# EAGLE design MegaU4Dev (EAGLE 5.11)
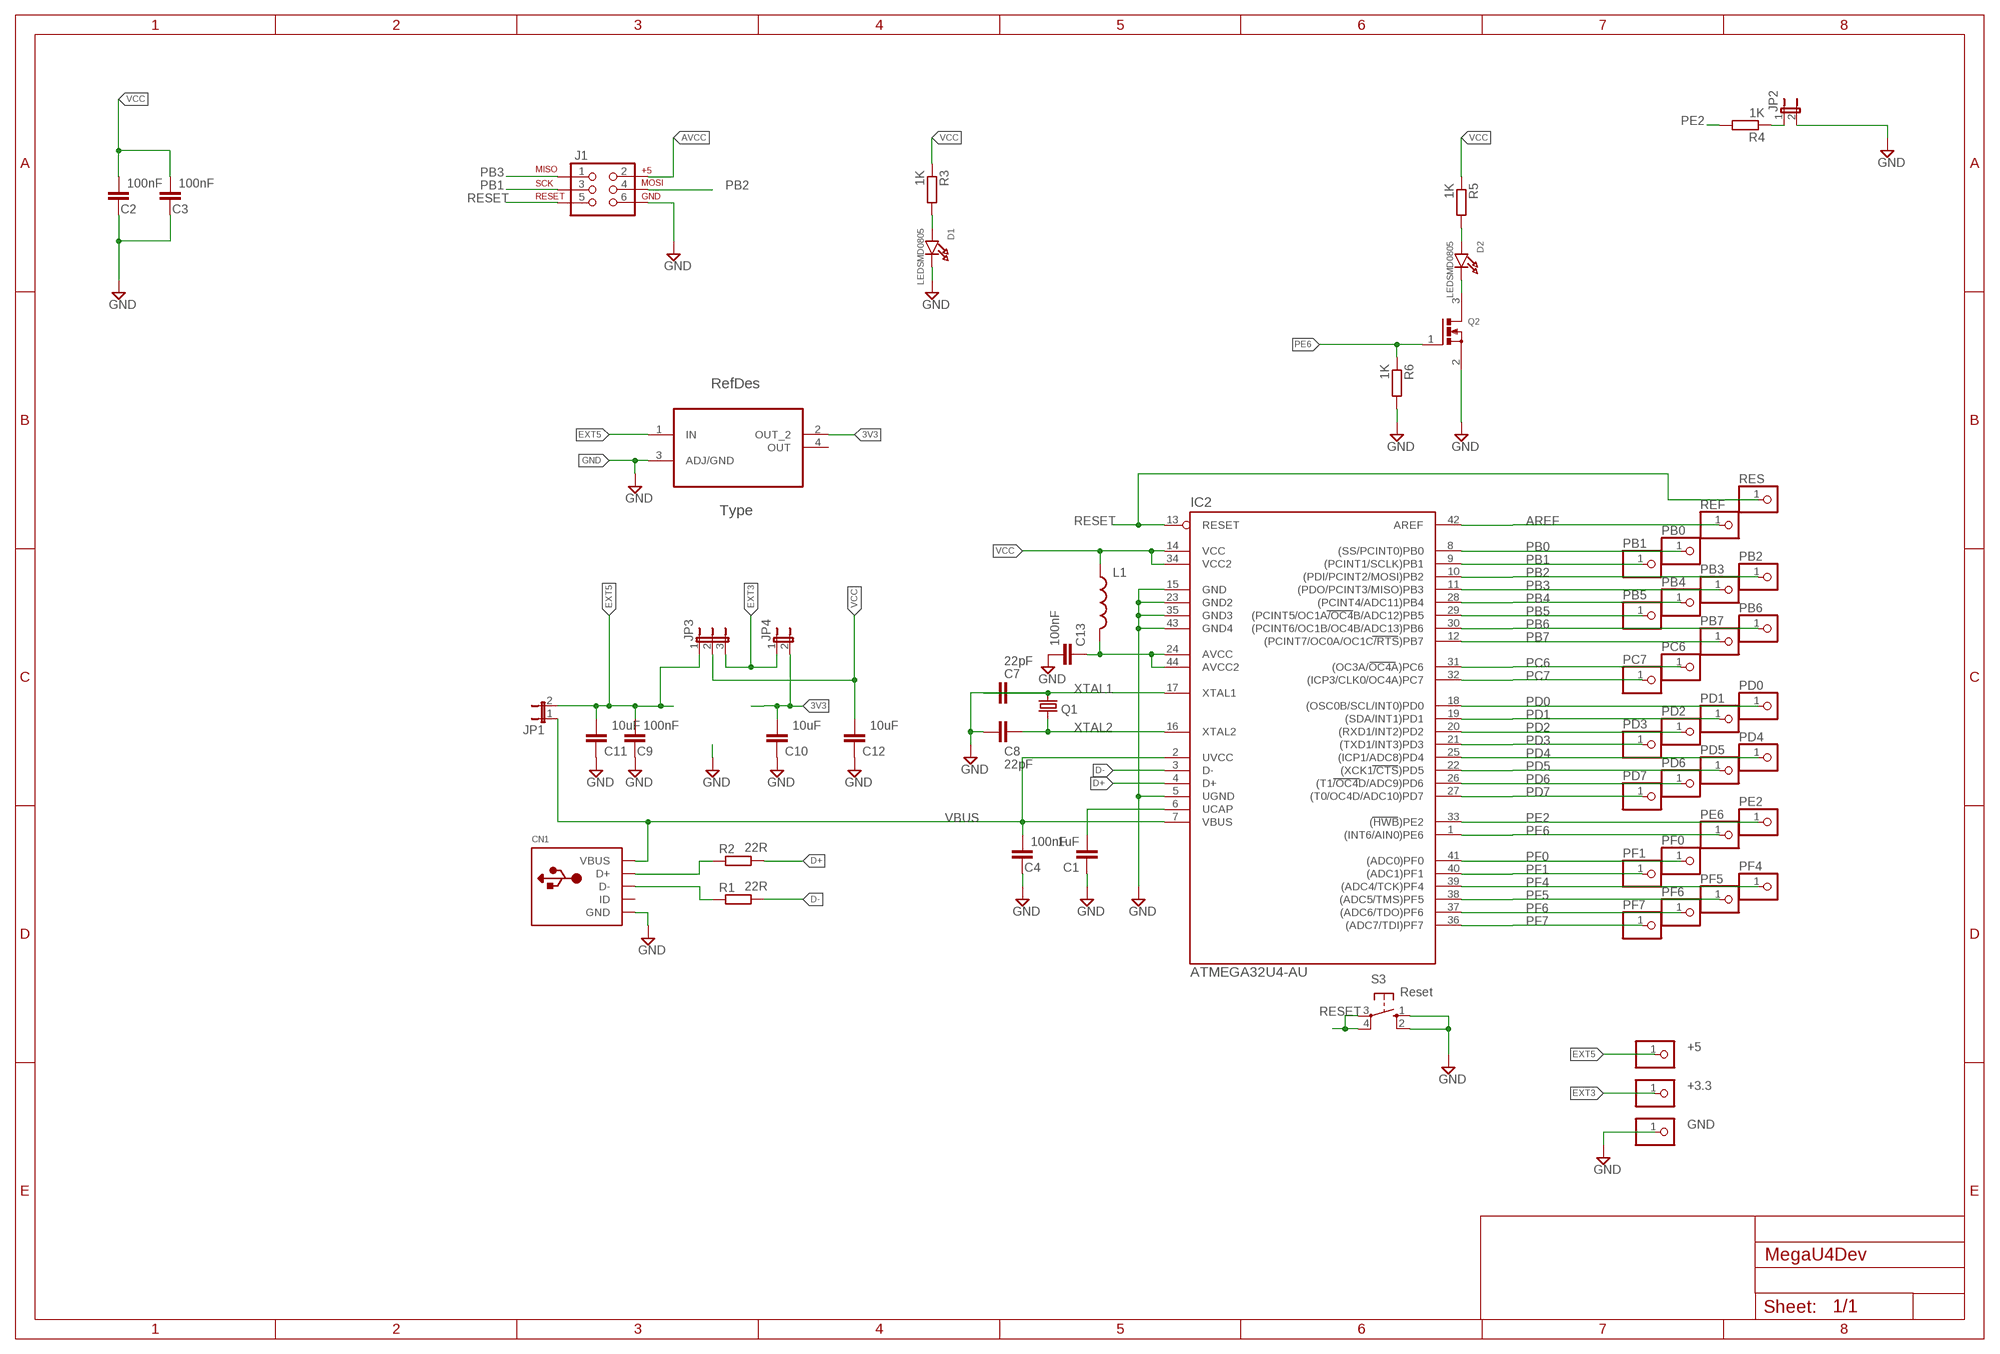
[diagram p0: schematic, sheet 1]

## Parts
+3.3  PINHD-1X1  [1X01]
+5  PINHD-1X1  [1X01]
C1  1uF  C-EUC0805  [C0805]
C2  100nF  C-EUC0805  [C0805]
C3  100nF  C-EUC0805  [C0805]
C4  100nF  C-EUC0805  [C0805]
C7  22pF  C-EUC0805  [C0805]
C8  22pF  C-EUC0805  [C0805]
C9  100nF  C-EUC0805  [C0805]
C10  10uF  C-EUC0805  [C0805]
C11  10uF  C-EUC0805  [C0805]
C12  10uF  C-EUC0805  [C0805]
C13  100nF  C-EUC0805  [C0805]
CN1  USBMINIB  [USB-MINIB]
D1  LEDSMD0805  [CHIPLED_0805]
D2  LEDSMD0805  [CHIPLED_0805]
GND  PINHD-1X1  [1X01]
IC2  ATMEGA32U4-AU  [TQFP44]
J1  AVR_SPI_PRG_6NS  [2X3-NS]
JP1  JP1E  [JP1]
JP2  JUMPER-2PTH  [1X02]
JP3  JP2E  [JP2]
JP4  JP1E  [JP1]
L1  INDUCTOR0805  [0805]
PB0  PINHD-1X1  [1X01]
PB1  PINHD-1X1  [1X01]
PB2  PINHD-1X1  [1X01]
PB3  PINHD-1X1  [1X01]
PB4  PINHD-1X1  [1X01]
PB5  PINHD-1X1  [1X01]
PB6  PINHD-1X1  [1X01]
PB7  PINHD-1X1  [1X01]
PC6  PINHD-1X1  [1X01]
PC7  PINHD-1X1  [1X01]
PD0  PINHD-1X1  [1X01]
PD1  PINHD-1X1  [1X01]
PD2  PINHD-1X1  [1X01]
PD3  PINHD-1X1  [1X01]
PD4  PINHD-1X1  [1X01]
PD5  PINHD-1X1  [1X01]
PD6  PINHD-1X1  [1X01]
PD7  PINHD-1X1  [1X01]
PE2  PINHD-1X1  [1X01]
PE6  PINHD-1X1  [1X01]
PF0  PINHD-1X1  [1X01]
PF1  PINHD-1X1  [1X01]
PF4  PINHD-1X1  [1X01]
PF5  PINHD-1X1  [1X01]
PF6  PINHD-1X1  [1X01]
PF7  PINHD-1X1  [1X01]
Q1  CRYSTALSM49  [SM49]
Q2  MOSFET-NWAVE  [SOT23-W]
R1  22R  R-EU_M0805  [M0805]
R2  22R  R-EU_M0805  [M0805]
R3  1K  R-EU_M0805  [M0805]
R4  1K  R-EU_M0805  [M0805]
R5  1K  R-EU_M0805  [M0805]
R6  1K  R-EU_M0805  [M0805]
REF  PINHD-1X1  [1X01]
RES  PINHD-1X1  [1X01]
S3  Reset  10-XX  [B3F-10XX]
U1  TLV1117-33CDCYW  [SOT223]

## Nets
3V3: C10.2 JP4.2 U1.2(OUT_2)
AREF: IC2.42(AREF) REF.1
AVCC: C13.1 IC2.24(AVCC) IC2.44(AVCC2) J1.2 L1.2
D+: IC2.4(D+) R2.2
D-: IC2.3(D-) R1.2
EXT3: +3.3.1 JP3.3 JP4.1
EXT5: +5.1 C9.2 C11.2 JP1.2 JP3.1 U1.1(IN)
GND: C1.1 C2.1 C3.1 C4.1 C7.2 C8.2 C9.1 C10.1 C11.1 C12.1 C13.2 CN1.GND D1.C GND.1 IC2.5(UGND) IC2.15(GND) IC2.23(GND2) IC2.35(GND3) IC2.43(GND4) J1.6 JP2.2 Q2.2(S) R6.2 S3.1(S) S3.2(S1) U1.3(ADJ/GND)
N$1: JP2.1 R4.1
N$2: CN1.D- R1.1
N$3: CN1.D+ R2.1
N$5: D2.A R5.2
N$6: D1.A R3.2
N$7: D2.C Q2.3(D)
PB0: IC2.8((SS/PCINT0)PB0) PB0.1
PB1: IC2.9((PCINT1/SCLK)PB1) J1.3 PB1.1
PB2: IC2.10((PDI/PCINT2/MOSI)PB2) J1.4 PB2.1
PB3: IC2.11((PDO/PCINT3/MISO)PB3) J1.1 PB3.1
PB4: IC2.28((PCINT4/ADC11)PB4) PB4.1
PB5: IC2.29((PCINT5/OC1A/OC4B/ADC12)PB5) PB5.1
PB6: IC2.30((PCINT6/OC1B/OC4B/ADC13)PB6) PB6.1
PB7: IC2.12((PCINT7/OC0A/OC1C/RTS)PB7) PB7.1
PC6: IC2.31((OC3A/OC4A)PC6) PC6.1
PC7: IC2.32((ICP3/CLK0/OC4A)PC7) PC7.1
PD0: IC2.18((OSC0B/SCL/INT0)PD0) PD0.1
PD1: IC2.19((SDA/INT1)PD1) PD1.1
PD2: IC2.20((RXD1/INT2)PD2) PD2.1
PD3: IC2.21((TXD1/INT3)PD3) PD3.1
PD4: IC2.25((ICP1/ADC8)PD4) PD4.1
PD5: IC2.22((XCK1/CTS)PD5) PD5.1
PD6: IC2.26((T1/OC4D/ADC9)PD6) PD6.1
PD7: IC2.27((T0/OC4D/ADC10)PD7) PD7.1
PE2: IC2.33((HWB)PE2) PE2.1 R4.2
PE6: IC2.1((INT6/AIN0)PE6) PE6.1 Q2.1(G) R6.1
PF0: IC2.41((ADC0)PF0) PF0.1
PF1: IC2.40((ADC1)PF1) PF1.1
PF4: IC2.39((ADC4/TCK)PF4) PF4.1
PF5: IC2.38((ADC5/TMS)PF5) PF5.1
PF6: IC2.37((ADC6/TDO)PF6) PF6.1
PF7: IC2.36((ADC7/TDI)PF7) PF7.1
RESET: IC2.13(RESET) J1.5 RES.1 S3.3(P) S3.4(P1)
UCAP: C1.2 IC2.6(UCAP)
VBUS: C4.2 CN1.VBUS IC2.2(UVCC) IC2.7(VBUS) JP1.1
VCC: C2.2 C3.2 C12.2 IC2.14(VCC) IC2.34(VCC2) JP3.2 L1.1 R3.1 R5.1
XTAL1: C7.1 IC2.17(XTAL1) Q1.2
XTAL2: C8.1 IC2.16(XTAL2) Q1.1
Unconnected: CN1.ID U1.4(OUT)

## Library data of the parts
+3.3 +5 GND PB0 PB1-PB7 PC6 PC7 PD0 PD1-PD7 PE2 PE6 PF0 PF1 PF4-PF7 REF RES = adafruit:PINHD-1X1: Pin header 1x1 for 0.1" spacing With round pins
C1-C4 C7-C13 = rcl:C-EU: CAPACITOR, European symbol
CN1 = adafruit:USB: USB Connectors USBMINIB - Surface Mount Female Mini-B USB Connector 4UConnector: 06564 By microbuilder.eu Thru-hole RA Female Mini-B USB Connector 4UConnector: 18732 By ladyada.net
D1 D2 = SmallRoomLabs:LED
IC2 = mega32U4:ATMEGA32U4-AU
J1 = SparkFun:AVR_SPI_PRG_6: AVR ISP 6 Pin This is the reduced ISP connector for AVR programming. Common on Arduino. This footprint will take up less PCB space and can be used with a 10-pin to 6-pin adapter such as SKU: BOB-08508
JP1 JP4 = jumper:JP1E: JUMPER
JP2 = SparkFun:JUMPER-2: Jumper Basic 0.1" spaced jumper. Use with breakaway headers.
JP3 = jumper:JP2E: JUMPER
L1 = SparkFun:INDUCTOR: Inductors Basic Inductor/Choke - 0603 and 1206. Footprints are not proven and vary greatly between part numbers.
Q1 = crystal:CRYSTAL: CRYSTAL; OC_FARNELL: unknown; OC_NEWARK: unknown
Q2 = microbuilder:MOSFET-N: N-Channel Mosfet Digikey: 2N7002ET1GOSTR-ND
R1-R6 = rcl:R-EU_: RESISTOR, European symbol
S3 = switch-omron:10-XX: OMRON SWITCH; MPN: B3F-1000; OC_FARNELL: 176432; OC_NEWARK: 36M3542
U1 = SmallRoomLabs:TLV1117-33CDCY: ADJUSTABLE AND FIXED LOW-DROPOUT VOLTAGE REGULATOR

## Net classes
0 default: width 0.203 mm, clearance 0.203 mm

## Board
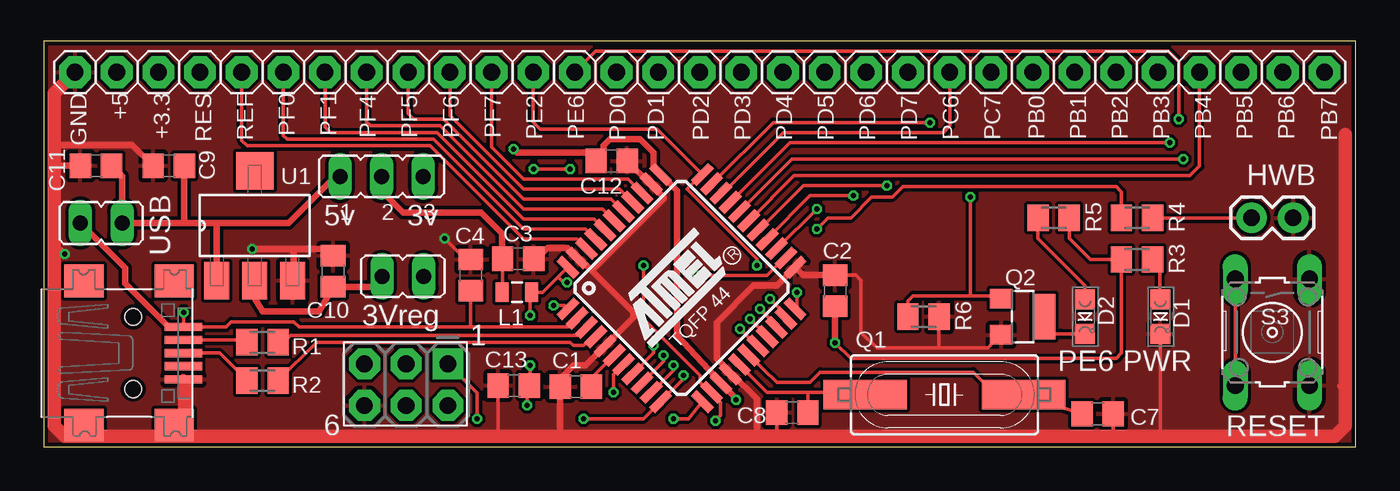
[diagram p1: board, top side]
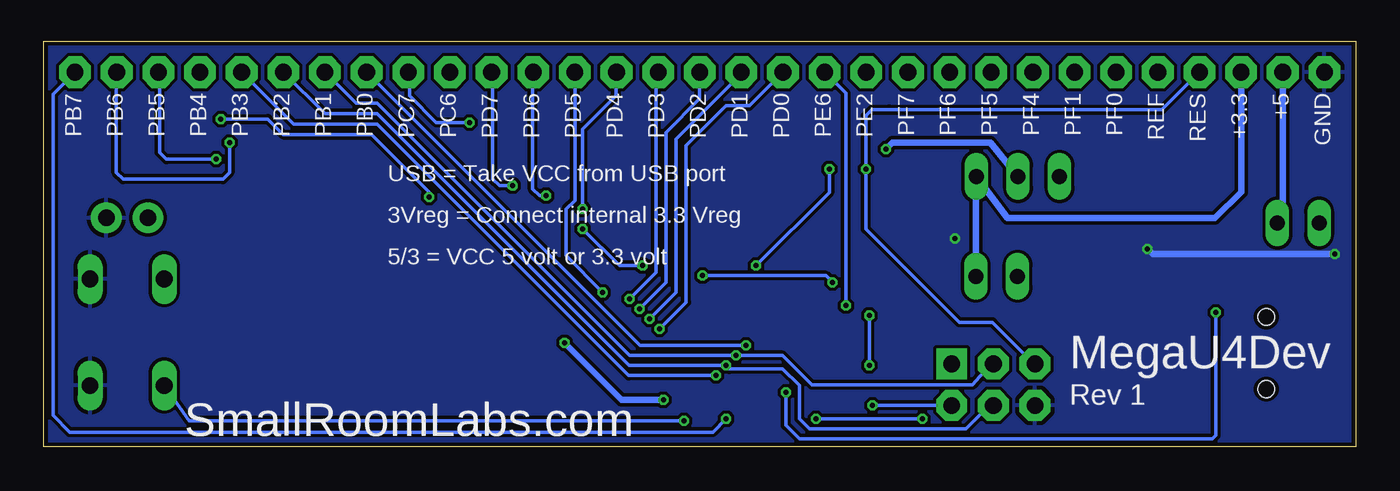
[diagram p2: board, bottom side, seen from below]

Size 80.01 x 24.77 mm. Coordinates in mm from the lower left corner, seen from the top.
Outline: 0,0 80.01,0 80.01,24.77 0,24.77 0,0
Copper layers (1*16): Top 0.035mm / dielectric 1.5mm / Bottom 0.035mm
Design rules "Fusion_eagle_rule_v1.1": minimum track width 6mil, minimum drill 12mil, track to track 6mil, track to pad 6mil, pad to pad 6mil, via to via 6mil, smd to smd 0mil, copper to edge 10mil, drill to drill 10mil, minimum pad ring 10mil, minimum via ring 6mil, stop-mask expansion 2mil, vias tented up to drill 100mil, thermal gap 10mil

### Footprints (pad centres in the part's own frame; a part is rotated, then mirrored left to right if it is on the bottom)
1X01 = drill 1.016 pad 1.93 octagon: 1 0,0
C0805 = smd 1.3 x 1.5: 1 -0.95,0; 2 0.95,0
USB-MINIB = smd 0.5 x 2.308: D+ 0,4.064; D- -0.8,4.064; GND 1.6,4.064; ID 0.8,4.064; VBUS -1.6,4.064 | smd 2 x 2.4: GND1 -4.4,-2; GND2 -4.4,3.5; GND3 4.4,3.5; GND4 4.4,-2 | hole 1: -2.2,1; 2.2,1
CHIPLED_0805 = smd 1.2 x 1.2: A 0,-1.05; C 0,1.05
TQFP44 = smd 1.5 x 0.5: 1 -5.8,4; 2 -5.8,3.2; 3 -5.8,2.4; 4 -5.8,1.6; 5 -5.8,0.8; 6 -5.8,0; 7 -5.8,-0.8; 8 -5.8,-1.6; 9 -5.8,-2.4; 10 -5.8,-3.2; 11 -5.8,-4; 23 5.8,-4; 24 5.8,-3.2; 25 5.8,-2.4; 26 5.8,-1.6; 27 5.8,-0.8; 28 5.8,0; 29 5.8,0.8; 30 5.8,1.6; 31 5.8,2.4; 32 5.8,3.2; 33 5.8,4 | smd 0.5 x 1.5: 12 -4,-5.8; 13 -3.2,-5.8; 14 -2.4,-5.8; 15 -1.6,-5.8; 16 -0.8,-5.8; 17 0,-5.8; 18 0.8,-5.8; 19 1.6,-5.8; 20 2.4,-5.8; 21 3.2,-5.8; 22 4,-5.8; 34 4,5.8; 35 3.2,5.8; 36 2.4,5.8; 37 1.6,5.8; 38 0.8,5.8; 39 0,5.8; 40 -0.8,5.8; 41 -1.6,5.8; 42 -2.4,5.8; 43 -3.2,5.8; 44 -4,5.8
2X3-NS = drill 1.016 pad 1.88 square: 1 -2.54,-1.27 | drill 1.016 pad 1.88 octagon: 2 -2.54,1.27; 3 0,-1.27; 4 0,1.27; 5 2.54,-1.27; 6 2.54,1.27
JP1 = drill 0.914 long: 1 0,-1.27; 2 0,1.27
1X02 = drill 1.016 pad 1.88 round: 1 0,0; 2 2.54,0
JP2 = drill 0.914 long: 1 -2.54,0; 2 0,0; 3 2.54,0
0805 = smd 0.8 x 1.2: 1 -0.9,0; 2 0.9,0
SM49 = smd 5.08 x 1.778: 1 -4.826,0; 2 4.826,0
SOT23-W = smd 1.2 x 1.4: 1 -1.1,-1.3; 2 1.1,-1.3 | smd 2.8 x 1.4: 3 0,1.3
M0805 = smd 1.3 x 1.6: 1 -0.95,0; 2 0.95,0
B3F-10XX = drill 1.016 long: 1 -3.251,2.261; 2 3.251,2.261; 3 -3.251,-2.261; 4 3.251,-2.261
SOT223 = smd 2.286 x 1.524: 1 -3.353,2.311; 2 -3.353,0; 3 -3.353,-2.311 | smd 2.286 x 2.286: 4 3.353,0

### Placement (x,y rotation side)
+3.3  6.99,22.86 90 top
+5  4.45,22.86 90 top
C1  32.45,3.66 0 top
C2  48.26,9.53 270 top
C3  28.93,11.47 180 top
C4  26.04,10.48 270 top
C7  64.27,2.01 0 top
C8  45.66,2.08 180 top
C9  7.62,17.14 0 top
C10  17.64,10.71 270 top
C11  3.17,17.14 0 top
C12  34.63,17.44 180 top
C13  28.65,3.73 180 top
CN1  4.45,5.71 270 top
D1  68.1,7.94 180 top
D2  63.5,7.94 180 top
GND  1.91,22.86 90 top
IC2  38.89,9.69 45 top
J1  22.1,3.78 180 top
JP1  3.49,13.65 270 top
JP2  73.66,13.97 0 top
JP3  20.6,16.5 0 top
JP4  21.89,10.4 90 top
L1  28.85,9.42 0 top
PB0  60.33,22.86 90 top
PB1  62.87,22.86 90 top
PB2  65.41,22.86 90 top
PB3  67.94,22.86 90 top
PB4  70.48,22.86 90 top
PB5  73.03,22.86 90 top
PB6  75.56,22.86 90 top
PB7  78.11,22.86 90 top
PC6  55.24,22.86 90 top
PC7  57.78,22.86 90 top
PD0  34.92,22.86 90 top
PD1  37.47,22.86 90 top
PD2  40.01,22.86 90 top
PD3  42.55,22.86 90 top
PD4  45.09,22.86 90 top
PD5  47.62,22.86 90 top
PD6  50.16,22.86 90 top
PD7  52.7,22.86 90 top
PE2  29.84,22.86 90 top
PE6  32.38,22.86 90 top
PF0  14.61,22.86 90 top
PF1  17.14,22.86 90 top
PF4  19.68,22.86 90 top
PF5  22.23,22.86 90 top
PF6  24.77,22.86 90 top
PF7  27.3,22.86 90 top
Q1  54.93,3.17 0 top
Q2  59.69,7.94 270 top
R1  13.34,6.38 0 top
R2  13.34,4.04 0 top
R3  66.67,11.43 0 top
R4  66.67,13.97 180 top
R5  61.59,13.97 180 top
R6  53.66,7.94 0 top
REF  12.06,22.86 90 top
RES  9.53,22.86 90 top
S3  74.93,6.99 270 top
U1  12.86,13.49 90 top
U$1  [SRL-LOGO-BSTOP-10MM]  71.12,2.86 0 top

### Tracks (layer width: path | path; a pad name or v marks a point on that pad's centre or on a via)
3V3
  Top 0.406: C10.2 19.98,9.76 JP4.2 | C10.2 17.14,9.76 17.14,9.53 | U1.2 12.86,9.05 13.34,8.26 16.77,8.26 C10.2
AREF
  Top 0.203: IC2.42 32.51,12.68 29.26,12.68 23.57,18.36 16.56,18.36 12.39,18.36 12.06,18.69 REF.1
AVCC  (via drill 0.3)
  Top 0.203: 31.37,10.36 30.43,9.42 L1.2 29.67,9.42 v29.67,8 | 31.37,10.36 IC2.44 | v29.67,4.95 29.67,3.73 C13.1 29.46,3.6 v29.46,2.52 | IC2.24 45.18,11.52 44.09,10.44 v39.83,10.44 | v31.9,10.03 31.7,10.03 31.37,10.36
  Bottom 0.203: v29.67,4.95 v29.67,8 | v39.83,10.44 32.31,10.44 v31.9,10.03 | J1.2 v29.46,2.52
D+
  Top 0.203: IC2.4 33.46,6.72 32.92,6.17 32.31,6.17 32.11,6.38 17.07,6.38 16.62,6.38 R2.2
D-
  Top 0.203: IC2.3 33.01,7.28 32.51,6.78 15.14,6.78 15.04,6.78 14.92,6.67 14.58,6.67 R1.2
EXT3
  Bottom 0.406: JP4.1 23.16,16.47 JP3.3 21.25,13.97 8.57,13.97 6.99,15.56 +3.3.1
EXT5
  Top 0.406: 8.57,13.65 JP1.2 4.76,16.51 C11.2 | JP3.1 17.77,16.5 14.92,13.65 10.48,13.65 | 8.57,13.65 10.48,13.65 | C9.2 8.57,13.65 | 10.48,13.65 10.55,13.65 U1.1
  Bottom 0.406: +5.1 4.45,13.97 JP1.2
GND  (via drill 0.3)
  Top 0.203: 21.27,0.64 21.59,0.95 | 24.45,0.64 24.13,0.95 | C8.2 44.71,0.84 44.5,0.64 | C7.2 65.22,0.64 65.23,0.64 | 79.38,2.72 78.99,3.73 | 79.38,9.83 79.15,10.24 | 36.97,16.05 IC2.35 | 37.8,15.11 37.8,15.22 | 33.53,10.85 33.33,10.85 33.02,11.15 32.65,11.52 IC2.43 | C1.1 31.5,4.14 | C13.2 27.7,0.64 27.84,0.64 | D1.C 68.1,0.79 67.94,0.64 | Q2.2 57.59,6.03 55.24,6.03 54.61,6.03 | 54.61,6.03 50.8,6.03 49.85,6.99 49.85,10.16 49.53,10.47 C2.1 | R6.2 54.61,6.04 54.61,6.03 | C4.1 25.72,11.43 v24.45,12.7
  Top 0.406: C11.1 0.95,17.14 0.64,16.83 | C9.1 5.4,18.41 0.64,18.41 | 15.24,12.06 13.34,12.06 v12.7,12.06 | 15.24,12.06 17.23,12.06 C10.1 | 0.64,12.38 v1.27,11.75 | C12.1 36.97,16.05 37.8,15.22 | 33.53,10.85 37.8,15.11 | 33.02,11.15 35.97,8.2 35.97,7.89 IC2.5 33.03,4.95 32.31,4.95 31.5,4.14 | 31.5,0.64 C1.1 | C3.1 30.09,11.47 30.73,12.12 31.94,12.12 IC2.43 | 43.48,0.64 43.48,2.92 41.95,4.45 IC2.15 41.86,4.54 41.05,5.36 41.05,7.59 43.28,9.83 44.7,9.83 44.91,10.03 45.82,10.95 IC2.23 46.3,10.47 C2.1 | U1.3 15.24,10.14 15.24,12.06
  Top 0.61: CN1.GND 8.51,3.87 8.57,3.81
  Top 0.813: GND.1 0.64,21.59 0.64,18.41 0.64,16.83 0.64,12.38 0.64,1.27 1.27,0.64 8.57,0.64 | 8.57,0.64 21.27,0.64 24.45,0.64 27.84,0.64 31.5,0.64 43.48,0.64 44.5,0.64 46.53,0.64 63.8,0.64 65.23,0.64 66.67,0.64 67.94,0.64 78.74,0.64 79.38,1.27 79.38,2.72 79.38,9.83 79.38,19.05 | 8.57,0.64 8.57,3.81
  Bottom 0.406: v12.7,12.06 12.38,11.75 v1.27,11.75
  pour Bottom: 0,24.75 80,24.75 80,-0.26 0,-0.26
  pour Top: 0,24.77 80.01,24.77 80.01,0.32 0,0.32
N$1
  Top 0.203: R4.1 JP2.1
N$2
  Top 0.203: CN1.D- 12.24,6.51 R1.1
N$3
  Top 0.203: CN1.D+ 10.26,5.71 10.71,5.71 R2.1
N$5
  Top 0.203: D2.A 63.5,9.84 60.64,12.7 R5.2
N$6
  Top 0.203: D1.A 68.08,9.02 68.08,10.98 R3.2
N$7
  Top 0.203: D2.C 62.04,6.89 61.18,6.89 60.96,6.67 60.96,7.91 Q2.3
PB0  (via drill 0.3)
  Top 0.203: IC2.8 37.19,5.72 v37.19,6.17
  Bottom 0.203: v37.19,6.17 43.64,6.17 PB0.1
PB1  (via drill 0.3)
  Top 0.203: IC2.9 37.8,5.2 v37.8,5.56
  Bottom 0.203: J1.3 22.25,5.05 23.37,3.79 33.17,3.79 34.95,5.56 v37.8,5.56 44.3,5.56 59.69,20.95 60.96,20.95 PB1.1
PB2  (via drill 0.3)
  Top 0.203: IC2.10 38.41,4.67 v38.41,4.95
  Bottom 0.203: J1.4 22.35,2.52 23.77,1.09 33.33,1.09 33.93,1.7 33.93,3.73 34.95,4.75 38.2,4.75 v38.41,4.95 44.32,4.95 59.69,20.32 61.59,20.32 62.87,20.32 PB2.1
PB3  (via drill 0.3)
  Top 0.203: IC2.11 | IC2.11 39.01,4.15 v39.01,4.34 | IC2.11 37.62,2.75 36.58,1.7 v32.92,1.7 | v26.42,1.7 26.42,3.28 J1.1
  Bottom 0.203: v39.01,4.34 44.35,4.34 59.69,19.68 64.77,19.68 PB3.1 | v32.92,1.7 27.03,1.7 v26.42,1.7
PB4
  Top 0.203: IC2.28 45.74,16.54 69.9,16.54 70.48,17.12 PB4.1
PB5  (via drill 0.3)
  Top 0.203: IC2.29 45.63,17.55 v69.49,17.55
  Bottom 0.203: v69.49,17.55 72.54,17.55 72.95,17.96 72.95,22.78 PB5.1
PB6  (via drill 0.3)
  Top 0.203: IC2.30 45.52,18.57 v68.68,18.57
  Bottom 0.203: v68.68,18.57 68.68,16.74 69.09,16.33 75.18,16.33 75.59,16.74 75.59,22.84 PB6.1
PB7  (via drill 0.3)
  Top 0.203: v38.39,1.7 39.31,1.7 IC2.12
  Bottom 0.203: PB7.1 79.45,21.51 79.45,1.91 78.44,0.89 72.14,0.89 39.2,0.89 v38.39,1.7
PC6
  Top 0.203: IC2.31 41.42,15.48 45.11,19.18 54.86,19.18 55.27,19.58 55.27,22.84 PC6.1
PC7  (via drill 0.3)
  Top 0.203: IC2.32 40.76,16.05 44.5,19.79 v54.05,19.79
  Bottom 0.203: v54.05,19.79 56.08,19.79 57.71,21.41 57.71,22.78 PC7.1
PD0  (via drill 0.3)
  Top 0.203: IC2.18 43.51,6.15 v42.47,7.19
  Bottom 0.203: PD0.1 36.98,20.8 38.41,20.8 40.84,18.36 40.84,8.81 v42.47,7.19
PD1  (via drill 0.3)
  Top 0.203: IC2.19 44.12,6.75 v43.08,7.8
  Bottom 0.203: PD1.1 37.47,22.76 41.45,18.77 41.45,9.42 v43.08,7.8
PD2  (via drill 0.3)
  Top 0.203: IC2.20 44.69,7.41 v43.69,8.41
  Bottom 0.203: PD2.1 40.01,21.23 42.06,19.18 42.06,10.03 v43.69,8.41
PD3  (via drill 0.3)
  Top 0.203: v44.3,9.02 45.26,8.06 IC2.21
  Bottom 0.203: PD3.1 42.67,22.73 42.67,10.85 42.67,10.64 v44.3,9.02
PD4  (via drill 0.3)
  Top 0.203: IC2.25 44.73,12.09 v47.14,14.5
  Bottom 0.203: v47.14,14.5 47.14,19.38 45.11,21.41 45.11,22.84 PD4.1
PD5  (via drill 0.3)
  Top 0.203: v45.92,9.42 45.92,8.51 IC2.22
  Bottom 0.203: PD5.1 47.62,15.04 48.16,14.5 48.16,11.66 v45.92,9.42
PD6  (via drill 0.3)
  Top 0.203: IC2.26 44.12,12.71 46.74,15.32 v49.38,15.32
  Bottom 0.203: v49.38,15.32 49.78,15.32 50.19,15.72 50.19,22.84 PD6.1
PD7  (via drill 0.3)
  Top 0.203: IC2.27 43.62,13.22 46.33,15.93 v51.41,15.93
  Bottom 0.203: v51.41,15.93 52.22,15.93 52.63,16.33 52.63,22.78 PD7.1
PE2  (via drill 0.3)
  Top 0.203: PE2.1 29.84,19.81 30.28,19.38 37.4,19.38 IC2.33 40.11,16.61 39.22,15.72 43.48,11.46 v43.48,11.05 | 47.19,13.34 47.17,13.31 v47.14,13.28 47.83,13.97 49.21,13.97 50.48,15.24 51.75,15.24 52.39,15.88 64.14,15.88 65.41,15.88 65.72,15.56 R4.2
  Bottom 0.203: v43.48,11.05 44.91,11.05 v47.14,13.28
PE6  (via drill 0.3)
  Top 0.203: v31.09,8.61 31.76,8.61 31.76,8.41 IC2.1 | 58,9.43 Q2.1 | 58,9.43 57.9,9.53 | v69.22,20 69.22,23.5 68.58,24.13 54.29,24.13 33.66,24.13 PE6.1 | R6.1 52.71,8.89 53.02,9.21 56.52,9.21 | 56.52,9.21 57.78,9.21 58,9.43 | v56.52,15.24 56.52,9.21
  Bottom 0.203: PE6.1 31.09,21.57 v31.09,8.61 | v56.52,15.24 56.52,15.56 60.01,19.05 65.41,19.05 66.36,20 v69.22,20
PF0
  Top 0.203: IC2.41 33.03,13.28 29.26,13.28 23.77,18.77 18.9,18.77 16.87,18.77 14.83,18.77 14.61,19 PF0.1
PF1
  Top 0.203: IC2.40 33.55,13.89 29.26,13.89 23.98,19.18 20.73,19.18 17.48,19.18 17.14,19.51 PF1.1
PF4
  Top 0.203: IC2.39 34.07,14.5 29.26,14.5 24.18,19.58 21.74,19.58 19.91,19.58 19.68,19.81 PF4.1
PF5
  Top 0.203: IC2.38 34.6,15.11 29.26,15.11 24.38,19.99 23.37,19.99 22.55,19.99 22.23,20.32 PF5.1
PF6
  Top 0.203: IC2.37 35.12,15.72 29.26,15.72 24.77,20.22 PF6.1
PF7
  Top 0.203: IC2.36 35.64,16.33 29.26,16.33 27.3,18.29 PF7.1
RESET  (via drill 0.3)
  Top 0.203: S3.4 S3.3 | v36.58,11.05 36.58,7.8 37.59,6.78 40.03,4.34 40.03,3.94 40.65,3.32 IC2.13 40.73,3.24 41.27,2.69 41.27,2.22 41.27,1.91 v40.96,1.59 | v29.87,16.94 v32.11,16.94
  Bottom 0.203: RES.1 11.81,20.57 28.45,20.57 29.49,20.57 29.87,20.19 v29.87,16.94 29.87,13.28 24.18,7.59 22.15,7.59 19.61,5.05 J1.5 | v36.58,11.05 32.11,15.52 v32.11,16.94 | v40.96,1.59 71.16,1.59 S3.4
UCAP
  Top 0.203: IC2.6 33.4,4.19 C1.2
VBUS  (via drill 0.3)
  Top 0.203: v8.53,8.2 8.53,7.32 CN1.VBUS 11.1,7.32 11.11,7.3 11.43,7.62 15.24,7.62 15.56,7.3 26.04,7.3 | 34.75,4.41 IC2.7 | 34.75,4.41 v34.75,3.33 34.75,4.41 | IC2.2 31.98,7.3 30.8,7.3 26.04,7.3 | 26.04,7.3 C4.2
  Top 0.406: CN1.VBUS 7.61,7.32 4.97,9.96 4.97,10.91 JP1.1
  Bottom 0.203: v34.75,3.33 34.75,1.29 33.93,0.48 8.74,0.48 8.53,0.69 v8.53,8.2
VCC  (via drill 0.3)
  Top 0.203: C12.2 33.85,17.44 34.14,17.14 | L1.1 27.98,9.45 C3.2 | v48.26,6.35 49.21,5.4 64.77,5.4 65.41,5.4 65.72,5.71 R3.1 63.82,11.43 62.55,12.7 R5.1
  Top 0.406: 34.14,17.96 34.14,18.36 34.54,18.77 36.37,18.77 37.19,17.96 37.19,16.94 37.51,16.61 IC2.34 38.61,15.63 38.61,14.71 38.61,13.69 38.61,6.78 IC2.14 42.23,2.96 v42.23,2.86 | 34.14,17.96 34.14,17.14 | v28.65,18.16 28.85,17.96 34.14,17.96 | v48.26,6.35 C2.2 | JP3.2 20.6,15.6 21.91,14.29 26.67,14.29 27.94,13.02 27.94,11.51 C3.2
  Bottom 0.406: JP3.2 22.26,18.57 23.98,18.57 28.25,18.57 v28.65,18.16 | v48.26,6.35 44.77,2.86 v42.23,2.86
XTAL1
  Top 0.203: C7.1 Q1.2 59.7,3.12 58.12,3.12 56.69,4.55 47.35,4.55 46.74,3.94 44.7,3.94 IC2.17
XTAL2
  Top 0.203: IC2.16 43.04,4.38 44.09,3.33 46.53,3.33 | 46.53,3.33 49.95,3.33 Q1.1 | C8.1 46.61,3.25 46.53,3.33

### Text on the board
tPlace: HWB | 5v | 3v | USB | 3Vreg | 1 | PE6 | PWR | RESET | 6
bPlace: GND | +5 | +3.3 | RES | REF | PF0 | PF1 | PF4 | PF5 | PF6 | PF7 | PE2 | PE6 | PD0 | PD1 | PD2 | PD3 | PD4 | PD5 | PD6 | PD7 | PC6 | PC7 | PB0 | PB1 | PB2 | PB3 | PB4 | PB5 | PB6 | PB7 | USB = Take VCC from USB port | 3Vreg = Connect internal 3.3 Vreg | 5/3 = VCC 5 volt or 3.3 volt | MegaU4Dev | Rev 1 | SmallRoomLabs.com